# EAGLE design v0.2 (EAGLE 4.15)
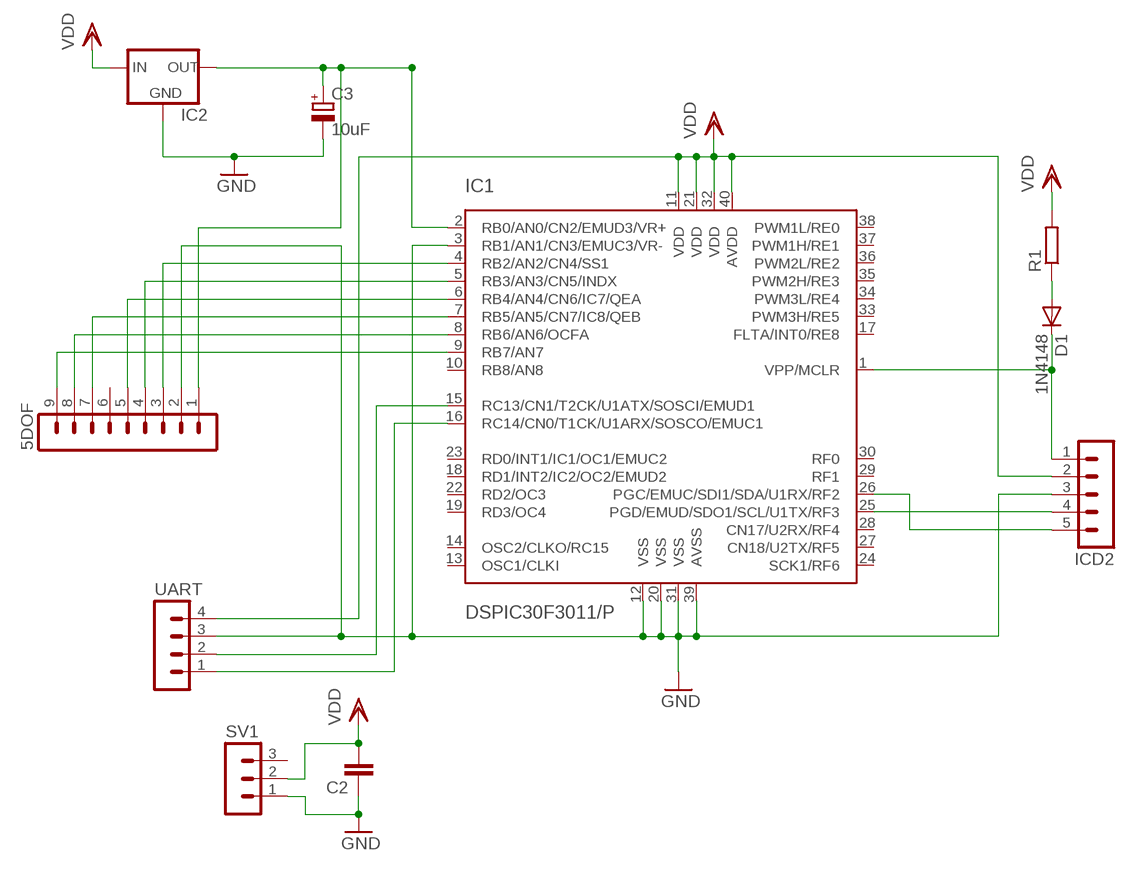
[diagram p0: schematic, sheet 1]

## Parts
5DOF  MA09-1  [MA09-1]
C2  C-EU050-024X044  [C050-024X044]
C3  10uF  CPOL-EUE2.5-6  [E2,5-6]
D1  1N4148  [DO35-10]
IC1  DSPIC30F3011/P  [DIL40]
IC2  78XXL  [78XXL]
ICD2  MA05-1  [MA05-1]
R1  R-EU_0207/10  [0207/10]
SV1  MA03-1  [MA03-1]
UART  MA04-1  [MA04-1]

## Nets
GND: 5DOF.2 C2.1 C3.- IC1.3(RB1/AN1/CN3/EMUC3/VR-) IC1.12(VSS) IC1.20(VSS) IC1.31(VSS) IC1.39(AVSS) IC2.GND ICD2.3 SV1.1 UART.3
N$1: IC1.26(PGC/EMUC/SDI1/SDA/U1RX/RF2) ICD2.5
N$2: IC1.25(PGD/EMUD/SDO1/SCL/U1TX/RF3) ICD2.4
N$3: 5DOF.1 C3.+ IC1.2(RB0/AN0/CN2/EMUD3/VR+) IC2.OUT
N$4: IC1.16(RC14/CN0/T1CK/U1ARX/SOSCO/EMUC1) UART.1
N$5: D1.C IC1.1(VPP/MCLR) ICD2.1
N$6: IC1.15(RC13/CN1/T2CK/U1ATX/SOSCI/EMUD1) UART.2
N$7: 5DOF.8 IC1.8(RB6/AN6/OCFA)
N$8: 5DOF.4 IC1.5(RB3/AN3/CN5/INDX)
N$9: D1.A R1.1
N$10: 5DOF.5 IC1.6(RB4/AN4/CN6/IC7/QEA)
N$11: 5DOF.7 IC1.7(RB5/AN5/CN7/IC8/QEB)
N$12: 5DOF.3 IC1.4(RB2/AN2/CN4/SS1)
N$13: 5DOF.9 IC1.9(RB7/AN7)
VDD: C2.2 IC1.11(VDD) IC1.21(VDD) IC1.32(VDD) IC1.40(AVDD) IC2.IN ICD2.2 R1.2 SV1.2 UART.4
Unconnected: 5DOF.6 IC1.10(RB8/AN8) IC1.13(OSC1/CLKI) IC1.14(OSC2/CLKO/RC15) IC1.17(FLTA/INT0/RE8) IC1.18(RD1/INT2/IC2/OC2/EMUD2) IC1.19(RD3/OC4) IC1.22(RD2/OC3) IC1.23(RD0/INT1/IC1/OC1/EMUC2) IC1.24(SCK1/RF6) IC1.27(CN18/U2TX/RF5) IC1.28(CN17/U2RX/RF4) IC1.29(RF1) IC1.30(RF0) IC1.33(PWM3H/RE5) IC1.34(PWM3L/RE4) IC1.35(PWM2H/RE3) IC1.36(PWM2L/RE2) IC1.37(PWM1H/RE1) IC1.38(PWM1L/RE0) SV1.3

## Library data of the parts
5DOF = con-lstb:MA09-1: PIN HEADER
C2 = rcl:C-EU: CAPACITOR, European symbol
C3 = rcl:CPOL-EU: POLARIZED CAPACITOR, European symbol
D1 = diode:1N4148: DIODE high speed (Philips)
IC1 = microchip-dspic:DSPIC30F3011: dsPIC Motion Controller DSC
IC2 = v-reg2:78XXL: VOLTAGE REGULATOR
ICD2 = con-lstb:MA05-1: PIN HEADER
R1 = rcl:R-EU_: RESISTOR, European symbol
SV1 = con-lstb:MA03-1: PIN HEADER
UART = con-lstb:MA04-1: PIN HEADER

## Board
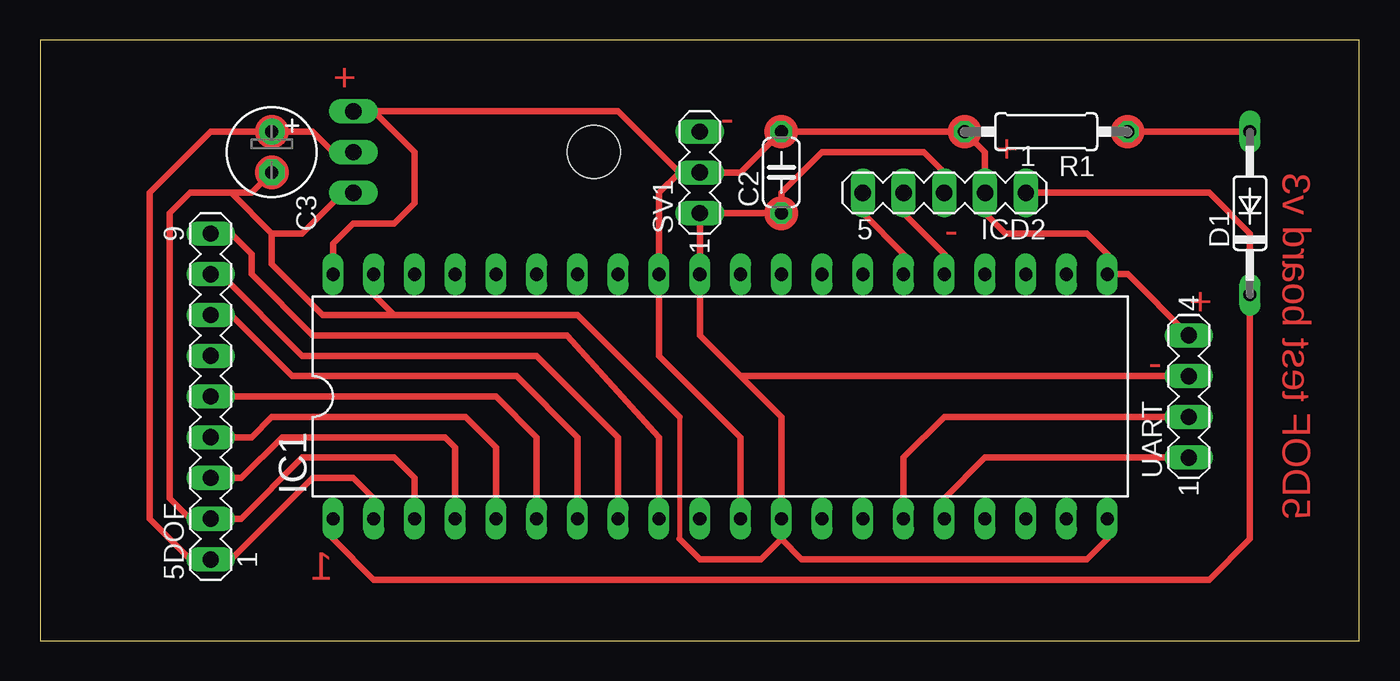
[diagram p1: board, top side]
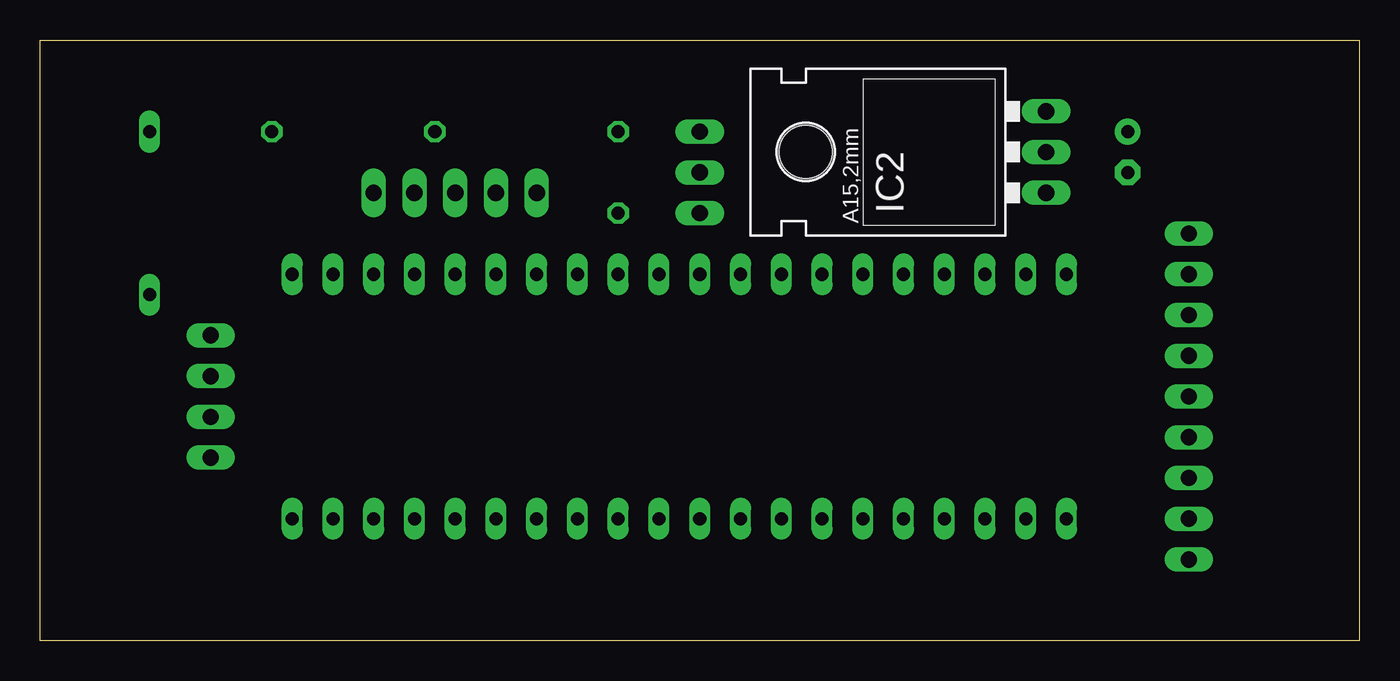
[diagram p2: board, bottom side, seen from below]

Size 82.22 x 37.45 mm. Coordinates in mm from the lower left corner, seen from the top.
Outline: 0,0 82.22,0 82.22,37.45 0,37.45 0,0
Copper layers (1*16): Top 0.035mm / dielectric 1.5mm / Bottom 0.035mm
Design rules "default": minimum track width 10mil, minimum drill 24mil, track to track 8mil, track to pad 8mil, pad to pad 8mil, via to via 8mil, smd to smd 8mil, copper to edge 40mil, drill to drill 8mil, minimum pad ring 10mil, minimum via ring 8mil, stop-mask expansion 4mil, vias tented up to drill 0mil, thermal gap 10mil

### Footprints (pad centres in the part's own frame; a part is rotated, then mirrored left to right if it is on the bottom)
MA09-1 = drill 1.016 long: 1 -10.16,0; 2 -7.62,0; 3 -5.08,0; 4 -2.54,0; 5 0,0; 6 2.54,0; 7 5.08,0; 8 7.62,0; 9 10.16,0
C050-024X044 = drill 0.813 octagon: 1 -2.54,0; 2 2.54,0
E2,5-6 = drill 0.813 pad 1.6 round: + -1.27,0 | drill 0.813 pad 1.6 octagon: - 1.27,0
DO35-10 = drill 0.813 long: A 5.08,0; C -5.08,0
DIL40 = drill 0.813 long: 1 -24.13,-7.62; 2 -21.59,-7.62; 3 -19.05,-7.62; 4 -16.51,-7.62; 5 -13.97,-7.62; 6 -11.43,-7.62; 7 -8.89,-7.62; 8 -6.35,-7.62; 9 -3.81,-7.62; 10 -1.27,-7.62; 11 1.27,-7.62; 12 3.81,-7.62; 13 6.35,-7.62; 14 8.89,-7.62; 15 11.43,-7.62; 16 13.97,-7.62; 17 16.51,-7.62; 18 19.05,-7.62; 19 21.59,-7.62; 20 24.13,-7.62; 21 24.13,7.62; 22 21.59,7.62; 23 19.05,7.62; 24 16.51,7.62; 25 13.97,7.62; 26 11.43,7.62; 27 8.89,7.62; 28 6.35,7.62; 29 3.81,7.62; 30 1.27,7.62; 31 -1.27,7.62; 32 -3.81,7.62; 33 -6.35,7.62; 34 -8.89,7.62; 35 -11.43,7.62; 36 -13.97,7.62; 37 -16.51,7.62; 38 -19.05,7.62; 39 -21.59,7.62; 40 -24.13,7.62
78XXL = drill 1.016 long: GND -2.54,-3.81; IN 2.54,-3.81; OUT 0,-3.81 | hole 3.302: 0,11.176
MA05-1 = drill 1.016 long: 1 -5.08,0; 2 -2.54,0; 3 0,0; 4 2.54,0; 5 5.08,0
0207/10 = drill 0.813 octagon: 1 -5.08,0; 2 5.08,0
MA03-1 = drill 1.016 long: 1 -2.54,0; 2 0,0; 3 2.54,0
MA04-1 = drill 1.016 long: 1 -3.81,0; 2 -1.27,0; 3 1.27,0; 4 3.81,0

### Placement (x,y rotation side)
5DOF  10.63,15.24 90 top
C2  46.19,29.21 90 top
C3  14.44,30.48 270 top
D1  75.4,26.67 90 top
IC1  42.38,15.24 0 top
IC2  23.33,30.48 90 bottom
ICD2  56.35,27.93 180 top
R1  62.7,31.75 180 top
SV1  41.11,29.21 90 top
UART  71.59,15.24 90 top

### Tracks (layer width: path | path; a pad name or v marks a point on that pad's centre or on a via)
GND
  Top 0.305: 39.84,13.96 39.84,6.35
  Top 0.406: 46.19,6.35 IC1.12 46.19,13.96 43.65,16.5 | IC1.31 41.11,19.04 43.65,16.5 | ICD2.3 56.35,29.21 55.08,30.48 48.73,30.48 46.19,27.93 C2.1 SV1.1 | IC1.31 SV1.1 | 43.65,16.5 UART.3 | IC1.20 66.51,6.35 65.24,5.08 47.46,5.08 46.19,6.35 | IC1.31 SV1.1 | 22.06,20.32 20.79,21.59 IC1.39 | 22.06,20.32 33.49,20.32 39.84,13.96 | 39.84,6.35 41.11,5.08 44.92,5.08 46.19,6.35 | 11.9,27.93 9.36,27.93 8.09,26.67 8.09,8.89 9.36,7.62 5DOF.2 12.54,7.62 16.34,11.43 22.06,11.43 23.33,10.16 IC1.3 | 11.9,27.93 14.44,25.39 | 14.44,25.39 14.44,23.49 17.62,20.32 22.06,20.32 | IC2.GND 18.88,27.93 16.34,25.39 14.44,25.39 | 11.9,27.93 13.17,27.93 C3.-
N$1
  Top 0.406: IC1.26 53.81,24.13 51.27,26.67 ICD2.5
N$2
  Top 0.406: ICD2.4 53.81,26.67 56.35,24.13 IC1.25
N$3
  Top 0.406: IC1.2 20.79,8.89 19.52,10.16 16.98,10.16 11.9,5.08 5DOF.1 9.36,5.08 6.82,7.62 6.82,27.93 10.63,31.75 C3.+ 16.98,31.75 18.25,30.48 IC2.OUT
N$4
  Top 0.406: UART.1 58.89,11.43 56.35,8.89 IC1.16
N$5
  Top 0.406: ICD2.1 72.86,27.93 75.4,25.39 D1.C 75.4,6.35 72.86,3.81 20.79,3.81 18.25,6.35 IC1.1
N$6
  Top 0.406: UART.2 56.35,13.96 53.81,11.43 IC1.15
N$7
  Top 0.406: IC1.8 36.03,12.7 30.95,17.78 16.34,17.78 11.26,22.86 5DOF.8
N$8
  Top 0.406: 5DOF.4 13.17,12.7 14.44,13.96 26.51,13.96 28.41,12.06 IC1.5
N$9
  Top 0.406: R1.1 D1.A
N$10
  Top 0.406: IC1.6 30.95,12.7 28.41,15.24 5DOF.5
N$11
  Top 0.406: 5DOF.7 11.9,20.32 15.71,16.5 29.68,16.5 33.49,12.7 IC1.7
N$12
  Top 0.406: IC1.4 25.87,12.06 25.23,12.7 15.08,12.7 12.54,10.16 5DOF.3
N$13
  Top 0.406: 5DOF.9 11.9,25.39 13.17,24.13 13.17,22.86 16.98,19.04 32.86,19.04 38.57,12.7 IC1.9
VDD
  Top 0.406: IC1.11 43.65,12.7 38.57,17.78 IC1.32 38.57,27.93 39.84,29.21 | UART.4 67.78,22.86 IC1.21 66.51,24.13 65.24,25.39 60.16,25.39 58.89,26.67 ICD2.2 58.89,30.48 R1.2 C2.2 43.65,29.21 SV1.2 39.84,29.21 | 39.84,29.21 36.03,33.02 IC2.IN 20.79,33.02 23.33,30.48 23.33,27.3 22.06,26.03 19.52,26.03 18.25,24.76 IC1.40
(copper drawn outside any net)
  shapes: Top circle x6

### Text on the board
Top: + | - | + | 5DOF test board v3 | - | + | - | 1